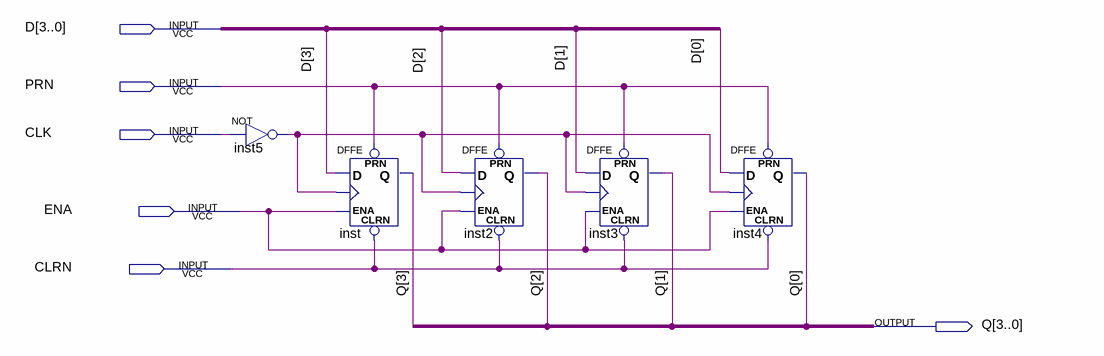
[diagram p0: schematic sheet]
// Quartus schematic recoder_4.bdf as structural Verilog: 5 symbols, 6 pins
module recoder_4 (
  input  [3:0] D,
  input  PRN,
  input  CLK,
  input  ENA,
  input  CLRN,
  output [3:0] Q
);

  wire inst5_out;

  not inst5 (inst5_out, CLK);
  DFFE inst (.PRN(PRN), .CLRN(CLRN), .D(D[3]), .CLK(inst5_out), .ENA(ENA), .Q(Q[3]));
  DFFE inst2 (.PRN(PRN), .CLRN(CLRN), .D(D[2]), .CLK(inst5_out), .ENA(ENA), .Q(Q[2]));
  DFFE inst3 (.PRN(PRN), .CLRN(CLRN), .D(D[1]), .CLK(inst5_out), .ENA(ENA), .Q(Q[1]));
  DFFE inst4 (.PRN(PRN), .CLRN(CLRN), .D(D[0]), .CLK(inst5_out), .ENA(ENA), .Q(Q[0]));
endmodule
